# Altium schematic sheet LISC_ProjectInformation.SchDoc: LISC
size A4; EditBy: +; Date: 2018-04-21; Author: EP; Organization: eptecon; Revision: A; SheetNumber: 2; SheetTotal: 5; PartNumber: 200511-000; DesignStatus: in progress; Project: LISC-XC95144XL; SheetTitle: Project Info; ProjectName: Project Name
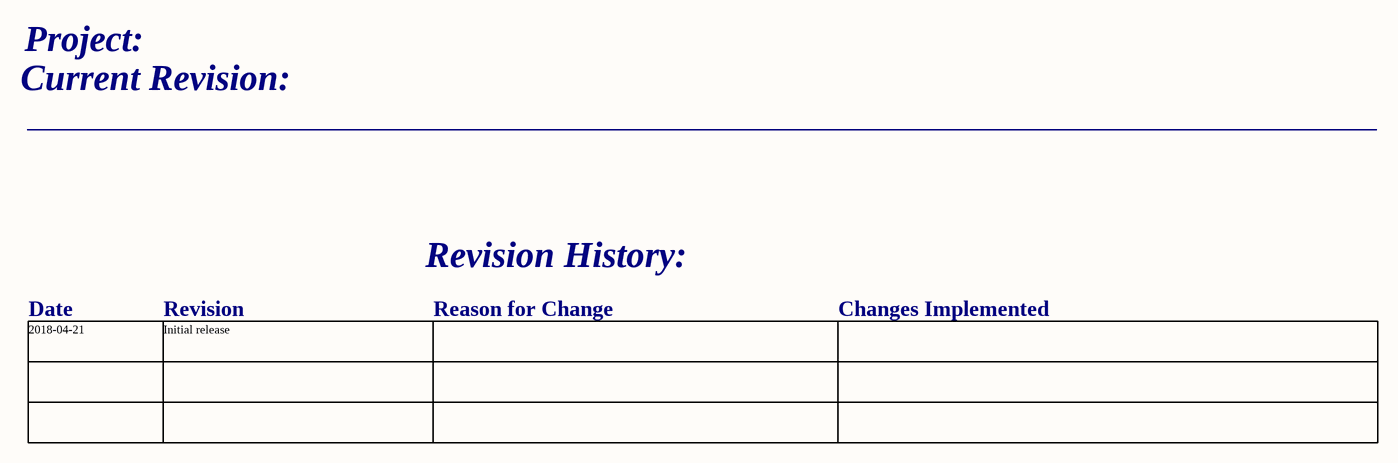
[diagram p0: LISC_ProjectInformation.SchDoc]

## Notes on the sheet
- Current Revision:
- Project:
- Date
- Revision
- Revision History:
- Reason for Change
- Changes Implemented
- 2018-04-21
- Initial release
- The reproduction, distribution and utilization of this document as well as communication of its content to others without express authorization is prohibited.
- Offenders will be held liable for the payment of damages.
- All rights reserved in the event of the grant of a patent, utility model or design.
- Status:
- Created by:
- Reviewed by:
- Date:
- Name:
- Title:
- Part number:
- Revision:
- Size:
- Sheet:
- of:
- Released by:
- A4